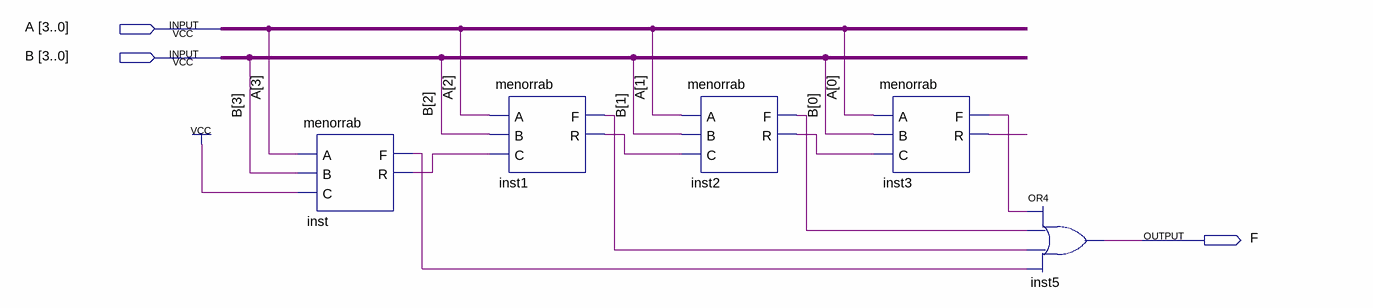
[diagram p0: schematic sheet]
// Quartus schematic menor4bit.bdf as structural Verilog: 5 symbols, 3 pins
module menor4bit (
  input  [3:0] A,
  input  [3:0] B,
  output F
);

  wire inst1_f, inst1_r, inst2_f, inst2_r, inst3_f, inst3_r, inst_f, inst_r;

  menorrab inst (.A(A[3]), .B(B[3]), .C(1'b1), .F(inst_f), .R(inst_r));
  menorrab inst1 (.A(A[2]), .B(B[2]), .C(inst_r), .F(inst1_f), .R(inst1_r));
  menorrab inst2 (.A(A[1]), .B(B[1]), .C(inst1_r), .F(inst2_f), .R(inst2_r));
  menorrab inst3 (.A(A[0]), .B(B[0]), .C(inst2_r), .F(inst3_f), .R(inst3_r));
  or inst5 (F, inst3_f, inst2_f, inst1_f, inst_f);
endmodule
